# Altium schematic sheet Filter.SchDoc
size A4; Organization: TESLA Motors, INC; Address1: 3500 Deer Creek Road; Address2: Palo Alto, CA; Address4: U.S.A.; SheetNumber: 2; SheetTotal: 2
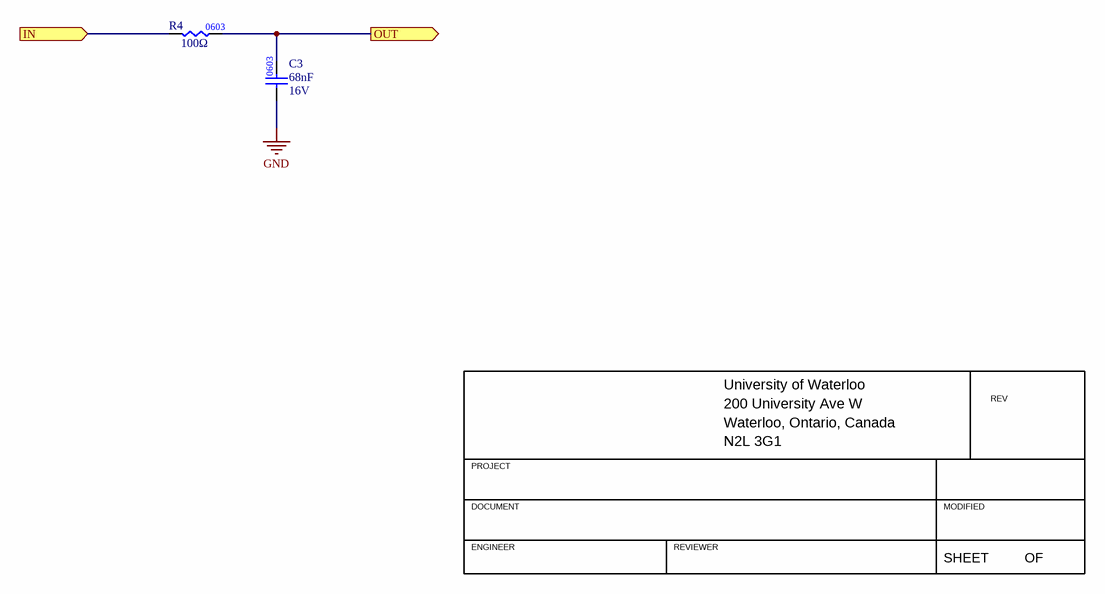
[diagram p0: Filter.SchDoc]

## Parts
C3  Capacitance: 68nF  Rated DC Voltage (URdc): 16V  [CAP0603]  (hidden comment: CAP_0.068uF_16V_X7R_0603)
R4  value 100Ω  [RES0603]  (hidden comment: RES_100Ω_0603_1%)

## Ports
IN (in, see Top[1B]), OUT (out, see Top[2B])

## Nets
GND: C3.1
IN: R4.1 ; port IN
OUT: C3.2 R4.2 ; port OUT

## Notes on the sheet
- University of Waterloo
- 200 University Ave W
- REV
- PROJECT
- Waterloo, Ontario, Canada
- N2L 3G1
- DOCUMENT
- ENGINEER
- REVIEWER
- MODIFIED
- SHEET
- OF
- (in symbol RES_100Ω_0603_1%) 0603

## Library data of the parts
C3 = CAP_0.068uF_16V_X7R_0603: CAP CER 0.068UF 16V X7R 0603; Manufacturer: KYOCERA AVX; Manufacturer Part Number: KGM15AR71C683KT; Mounting Type: Surface Mount; Temperature Characteristics Code: X7R; Package: 0603; Supplier 1: Digikey; Supplier Part Number 1: 478-KGM15AR71C683KTCT-ND
R4 = RES_100Ω_0603_1%: RES 100 OHM 1% 1/10W 0603; Manufacturer 1: Yageo; Manufacturer Part Number 1: RC0603FR-07100RL; Supplier Part Number 1: 311-100HRCT-ND; Supplier 1: Digi-Key